# EAGLE schematic Attenuator (EAGLE 9.6.2)
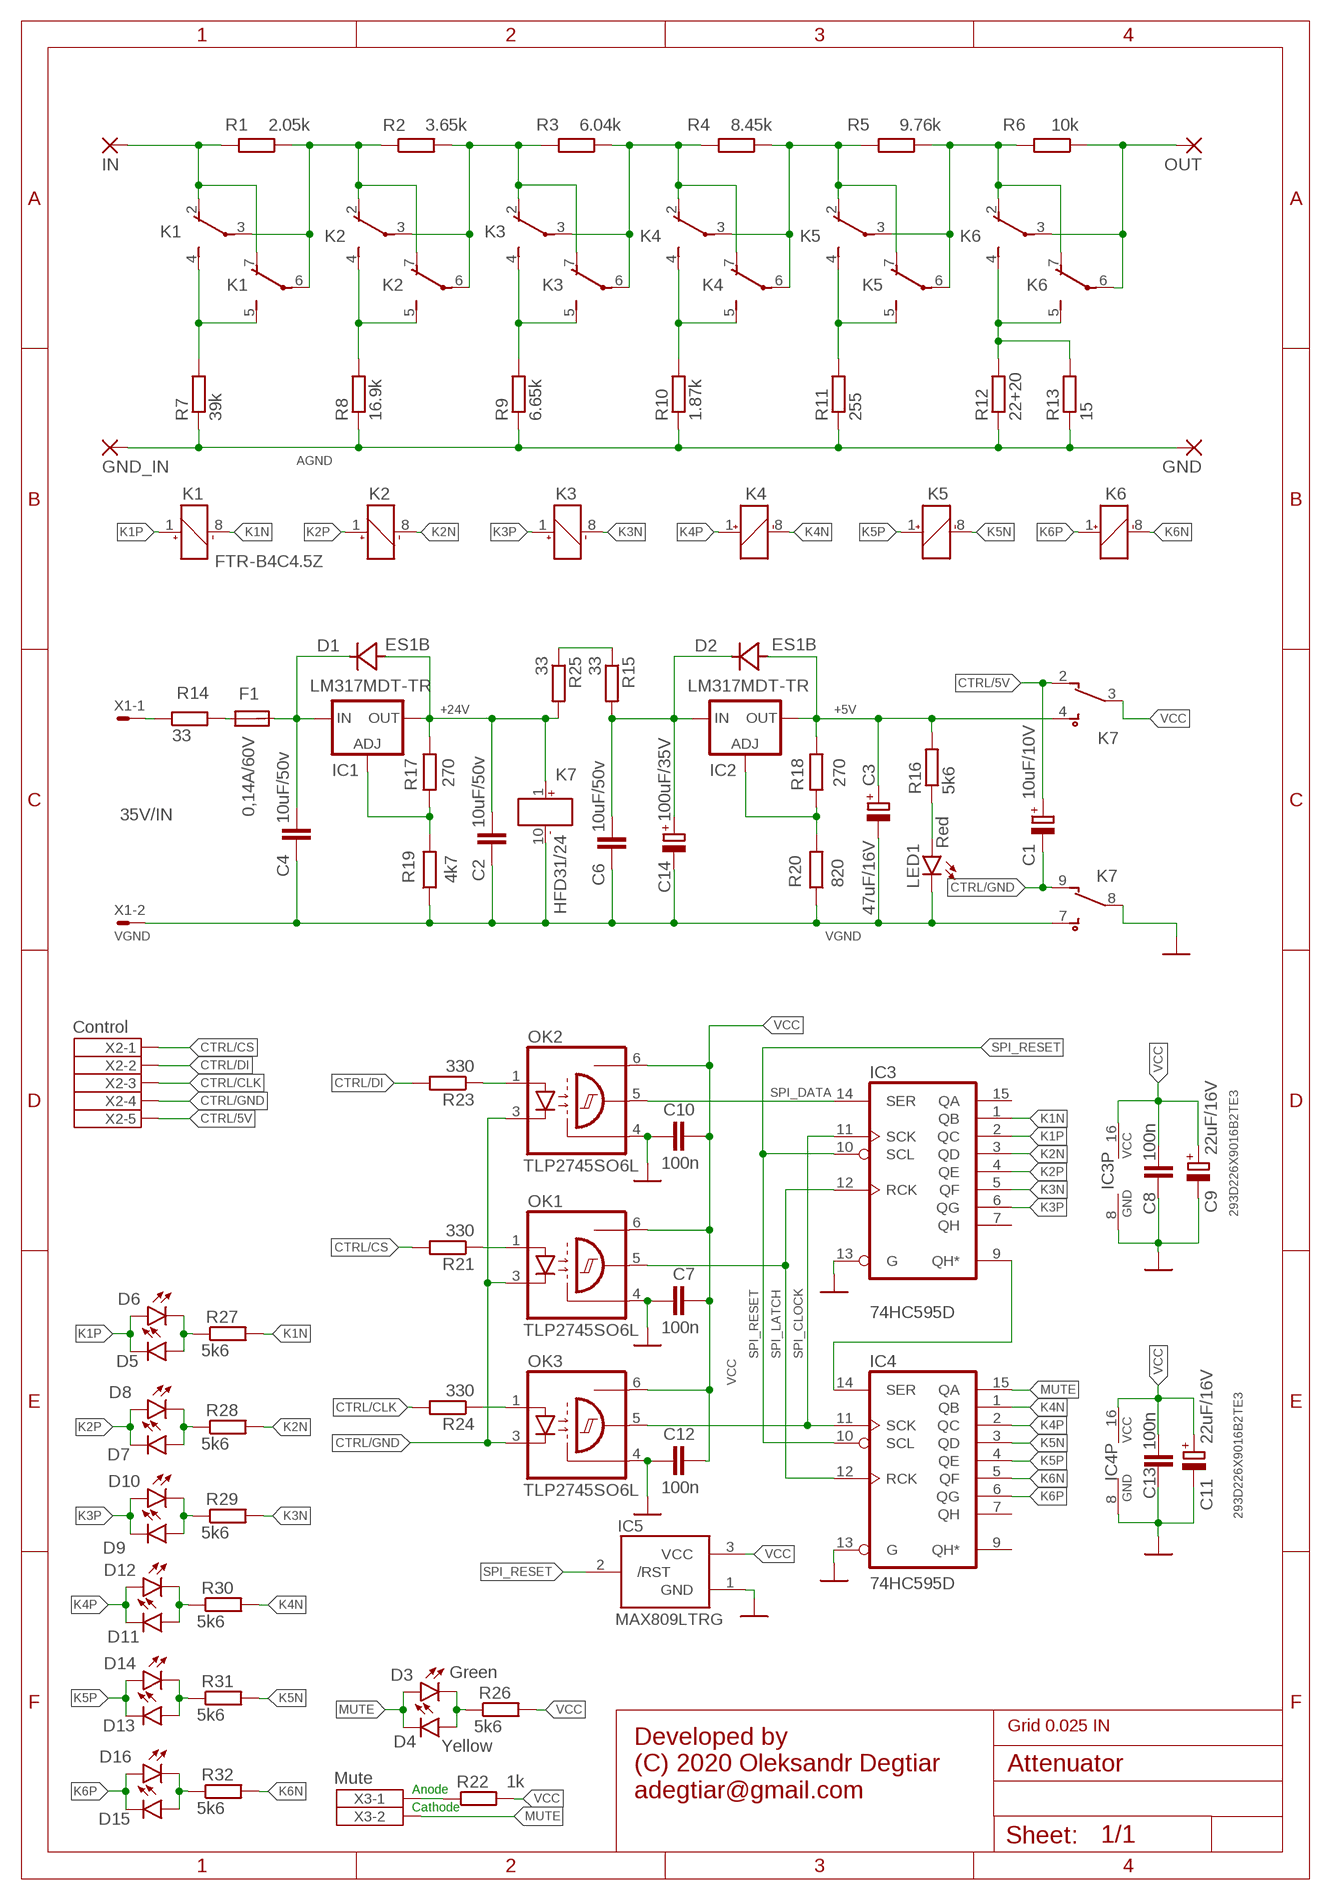
[diagram p0: schematic, sheet 1]

## Parts
C1  10uF/10V  CPOL-EUSMCA  [SMC_A]
C2  10uF/50v  C-EUC1206  [C1206]
C3  47uF/16V  CPOL-EUSMCC  [SMC_C]
C4  10uF/50v  C-EUC1206  [C1206]
C6  10uF/50v  C-EUC1206  [C1206]
C7  100n  C-EUC0603  [C0603]
C8  100n  C-EUC0603  [C0603]
C9  22uF/16V  CPOL-EUSMCB  [SMC_B]
C10  100n  C-EUC0603  [C0603]
C11  22uF/16V  CPOL-EUSMCB  [SMC_B]
C12  100n  C-EUC0603  [C0603]
C13  100n  C-EUC0603  [C0603]
C14  100uF/35V  CPOL-EUUD-6,3X8,8  [UD-6,3X5,8_NICHICON]
D1  ES1B  MBRA340T3  [SMA]
D2  ES1B  MBRA340T3  [SMA]
D3  Green  LEDCHIPLED_0805  [CHIPLED_0805]
D4  Yellow  LEDCHIPLED_0805  [CHIPLED_0805]
D5  LEDCHIPLED_0805  [CHIPLED_0805]
D6  LEDCHIPLED_0805  [CHIPLED_0805]
D7  LEDCHIPLED_0805  [CHIPLED_0805]
D8  LEDCHIPLED_0805  [CHIPLED_0805]
D9  LEDCHIPLED_0805  [CHIPLED_0805]
D10  LEDCHIPLED_0805  [CHIPLED_0805]
D11  LEDCHIPLED_0805  [CHIPLED_0805]
D12  LEDCHIPLED_0805  [CHIPLED_0805]
D13  LEDCHIPLED_0805  [CHIPLED_0805]
D14  LEDCHIPLED_0805  [CHIPLED_0805]
D15  LEDCHIPLED_0805  [CHIPLED_0805]
D16  LEDCHIPLED_0805  [CHIPLED_0805]
F1  0,14A/60V  MF-MSMF010-2  [MF-MSMF010-2]
GND  OUT_GND  2,54/1,1  [2,54/1,1]
GND_IN  IN_GND  2,54/1,1  [2,54/1,1]
IC1  LM317MDT-TR  LM317MBDTRK  [DPACK]
IC2  LM317MDT-TR  LM317MDT  [DPACK]
IC3  74HC595D  [SO16]
IC4  74HC595D  [SO16]
IC5  MAX809LTRG  MAX809JEUR  [SOT23]
IN  IN  2,54/1,1  [2,54/1,1]
K1  FTR-B4C4.5Z  FTR-B4C  [FTR-B4C]
K2  FTR-B4C4.5Z  FTR-B4C  [FTR-B4C]
K3  FTR-B4C4.5Z  FTR-B4C  [FTR-B4C]
K4  FTR-B4C4.5Z  FTR-B4C  [FTR-B4C]
K5  FTR-B4C4.5Z  FTR-B4C  [FTR-B4C]
K6  FTR-B4C4.5Z  FTR-B4C  [FTR-B4C]
K7  HFD31/24  HFD31  [HFD31]
LED1  Red  LEDCHIPLED_0805  [CHIPLED_0805]
OK1  TLP2745SO6L  [SO6L]
OK2  TLP2745SO6L  [SO6L]
OK3  TLP2745SO6L  [SO6L]
OUT  OUT  2,54/1,1  [2,54/1,1]
R1  2.05k  R-EU_R0805  [R0805]
R2  3.65k  R-EU_R0805  [R0805]
R3  6.04k  R-EU_R0805  [R0805]
R4  8.45k  R-EU_R0805  [R0805]
R5  9.76k  R-EU_R0805  [R0805]
R6  10k  R-EU_R0805  [R0805]
R7  39k  R-EU_R0805  [R0805]
R8  16.9k  R-EU_R0805  [R0805]
R9  6.65k  R-EU_R0805  [R0805]
R10  1.87k  R-EU_R0805  [R0805]
R11  255  R-EU_R0805  [R0805]
R12  22+20  R-EU_R0805  [R0805]
R13  15  R-EU_R0805  [R0805]
R14  33  R-EU_R1206  [R1206]
R15  33  R-EU_R1206  [R1206]
R16  5k6  R-EU_R0805  [R0805]
R17  270  R-EU_R0805  [R0805]
R18  270  R-EU_R0805  [R0805]
R19  4k7  R-EU_R0805  [R0805]
R20  820  R-EU_R0805  [R0805]
R21  330  R-EU_R0805  [R0805]
R22  1k  R-EU_R0805  [R0805]
R23  330  R-EU_R0805  [R0805]
R24  330  R-EU_R0805  [R0805]
R25  33  R-EU_R1206  [R1206]
R26  5k6  R-EU_R0805  [R0805]
R27  5k6  R-EU_R0805  [R0805]
R28  5k6  R-EU_R0805  [R0805]
R29  5k6  R-EU_R0805  [R0805]
R30  5k6  R-EU_R0805  [R0805]
R31  5k6  R-EU_R0805  [R0805]
R32  5k6  R-EU_R0805  [R0805]
X1  35V/IN  KK-156-2  [KK-156-2]
X2  Control  JST-XH-05-PIN-ROUND-PAD  [JST-XH-05-PACKAGE-ROUND-PAD]
X3  Mute  JST-XH-02-PIN-ROUND-PAD  [JST-XH-02-PACKAGE-ROUND-PAD]

## Nets
+5V: C3.+ D2.A IC2.4(OUT) K7.4(NO) R16.2 R18.1
+24V: C2.1 D1.A IC1.4(OUT) K7.1(K$1:+) R17.1 R25.2
+24V/IN: C6.1 C14.+ D2.C IC2.3(IN) R15.2
+35V/FUSE: F1.1 R14.2
+35V/IN: R14.1 X1.1
ADJ_VR1: IC1.1(ADJ) R17.2 R19.2
ADJ_VR2: IC2.1(ADJ) R18.2 R20.2
AGND: GND.1(P) GND_IN.1(P) R7.1 R8.1 R9.1 R10.1 R11.1 R12.1 R13.1
CTRL/5V: C1.+ K7.2(NC) X2.5
CTRL/CLK: R24.2 X2.3
CTRL/CS: R21.2 X2.1
CTRL/DI: R23.2 X2.2
CTRL/GND: C1.- K7.9(NC) OK1.3(C) OK2.3(C) OK3.3(C) X2.4
GND: C7.2 C8.2 C9.- C10.2 C11.- C12.2 C13.1 IC3.8(GND) IC3.13(G) IC4.8(GND) IC4.13(G) IC5.1(GND) K7.8(COM) OK1.4(GND) OK2.4(GND) OK3.4(GND)
K1N: IC3.1(QB) K1.8(K:-) R27.2
K1P: D5.C D6.A IC3.2(QC) K1.1(K:+)
K2N: IC3.3(QD) K2.8(K:-) R28.2
K2P: D7.C D8.A IC3.4(QE) K2.1(K:+)
K3N: IC3.5(QF) K3.8(K:-) R29.2
K3P: D9.C D10.A IC3.6(QG) K3.1(K:+)
K4N: IC4.1(QB) K4.8(K:-) R30.2
K4P: D11.C D12.A IC4.2(QC) K4.1(K:+)
K5N: IC4.3(QD) K5.8(K:-) R31.2
K5P: D13.C D14.A IC4.4(QE) K5.1(K:+)
K6N: IC4.5(QF) K6.8(K:-) R32.2
K6P: D15.C D16.A IC4.6(QG) K6.1(K:+)
LED_PWR_ON: LED1.A R16.1
MUTE: D3.A D4.C IC4.15(QA) X3.2
N$1: K5.4(-1:S) K5.5(-2:S) R11.2
N$2: K3.4(-1:S) K3.5(-2:S) R9.2
N$3: K2.4(-1:S) K2.5(-2:S) R8.2
N$4: K1.4(-1:S) K1.5(-2:S) R7.2
N$5: D5.A D6.C R27.1
N$6: K4.4(-1:S) K4.5(-2:S) R10.2
N$7: K4.3(-1:P) K4.6(-2:P) K5.2(-1:O) K5.7(-2:O) R4.1 R5.2
N$8: K1.3(-1:P) K1.6(-2:P) K2.2(-1:O) K2.7(-2:O) R1.1 R2.1
N$9: IN.1(P) K1.2(-1:O) K1.7(-2:O) R1.2
N$10: K2.3(-1:P) K2.6(-2:P) K3.2(-1:O) K3.7(-2:O) R2.2 R3.2
N$11: K3.3(-1:P) K3.6(-2:P) K4.2(-1:O) K4.7(-2:O) R3.1 R4.2
N$12: K6.3(-1:P) K6.6(-2:P) OUT.1(P) R6.1
N$13: R15.1 R25.1
N$14: D3.C D4.A R26.1
N$15: D7.A D8.C R28.1
N$16: R22.1 X3.1
N$17: D9.A D10.C R29.1
N$18: C4.1 D1.C F1.2 IC1.3(IN)
N$19: K5.3(-1:P) K5.6(-2:P) K6.2(-1:O) K6.7(-2:O) R5.1 R6.2
N$20: D11.A D12.C R30.1
N$21: D13.A D14.C R31.1
N$22: D15.A D16.C R32.1
N$28: K6.4(-1:S) K6.5(-2:S) R12.2 R13.2
N$36: OK1.1(A) R21.1
N$37: OK2.1(A) R23.1
N$43: OK3.1(A) R24.1
RG_CHAIN: IC3.9(QH*) IC4.14(SER)
SPI_CLOCK: IC3.11(SCK) IC4.11(SCK) OK3.5(OUT)
SPI_DATA: IC3.14(SER) OK2.5(OUT)
SPI_LATCH: IC3.12(RCK) IC4.12(RCK) OK1.5(OUT)
SPI_RESET: IC3.10(SCL) IC4.10(SCL) IC5.2(/RST)
VCC: C7.1 C8.1 C9.+ C10.1 C11.+ C12.1 C13.2 IC3.16(VCC) IC4.16(VCC) IC5.3(VCC) K7.3(COM) OK1.6(VCC) OK2.6(VCC) OK3.6(VCC) R22.2 R26.2
VGND: C2.2 C3.- C4.2 C6.2 C14.- K7.7(NO) K7.10(K$1:-) LED1.C R19.1 R20.1 X1.2
Unconnected: IC3.7(QH) IC3.15(QA) IC4.7(QH) IC4.9(QH*)

## Notes on the sheet
- Grid 0.025 IN
- Anode
- Developed by
  (C) 2020 Oleksandr Degtiar
  adegtiar@gmail.com
- Cathode

## Library data of the parts
C1 = rcl:CPOL-EU: POLARIZED CAPACITOR, European symbol; PARTNAME: TAJA106K010RNJ; SPICEPREFIX: C
C2 C4 C6 = rcl:C-EU: CAPACITOR, European symbol; BUY_URL: https://imrad.com.ua/ru/cl31b106kbhnnne-product-244463; PARTNAME: CL31B106KBHNNNE; SPICEPREFIX: C
C3 = rcl:CPOL-EU: POLARIZED CAPACITOR, European symbol; PARTNAME: 293D476X9016C2TE3; SPICEPREFIX: C
C7 C8 C10 C12 C13 = rcl:C-EU: CAPACITOR, European symbol; SPICEPREFIX: C
C9 C11 = rcl:CPOL-EU: POLARIZED CAPACITOR, European symbol; PARTNAME: 293D226X9016B2TE3; SPICEPREFIX: C
C14 = rcl:CPOL-EU: POLARIZED CAPACITOR, European symbol; PARTNAME: EEEFK1V101XP; SPICEPREFIX: C
D1 D2 = diode:MBRA340T3: Surface Mount Schottky Power Rectifier Source: http://www.onsemi.com/pub_link/Collateral/MBRA340T3-D.PDF
D3-D16 LED1 = led:LED: LED OSRAM: - CHIPLED LG R971, LG N971, LY N971, LG Q971, LY Q971, LO R971, LY R971 LH N974, LH R974 LS Q976, LO Q976, LY Q976 LO Q996 - Hyper CHIPLED LW Q18S LB Q993, LB Q99A, LB R99A - SideLED LS A670, LO A670, LY A670, LG A670, LP A670 LB A673, LV A673, LT A673, LW A673 LH A674 LY A675 LS A676, LA A676, LO A676, LY A676, LW A676 LS A679, LY A679, LG A679 - Hyper Micro SIDELED® LS Y876, LA Y876, LO Y876, LY Y876 LT Y87S - SmartLED LW L88C, LW L88S LB L89C, LB L89S, LG L890 LS L89K, LO L89K, LY L89K LS L896, LA L896, LO L896, LY L896 - TOPLED LS T670, LO T670, LY T670, LG T670, LP T670 LSG T670, LSP T670, LSY T670, LOP T670, LYG T670 LG T671, LOG T671, LSG T671 LB T673, LV T673, LT T673, LW T673 LH T674 LS T676, LA T676, LO T676, LY T676, LB T676, LH T676, LSB T676, LW T676 LB T67C, LV T67C, LT T67C, LS T67K, LO T67K, LY T67K, LW E67C LS E67B, LA E67B, LO E67B, LY E67B, LB E67C, LV E67C, LT E67C LW T67C LS T679, LY T679, LG T679 LS T770, LO T770, LY T770, LG T770, LP T770 LB T773, LV T773, LT T773, LW T773 LH T774 LS E675, LA E675, LY E675, LS T675 LS T776, LA T776, LO T776, LY T776, LB T776 LHGB T686 LT T68C, LB T68C - Hyper Mini TOPLED® LB M676 - Mini TOPLED Santana® LG M470 LS M47K, LO M47K, LY M47K Source: http://www.osram.convergy.de LUXEON: - LUMILED® LXK2-PW12-R00, LXK2-PW12-S00, LXK2-PW14-U00, LXK2-PW14-V00 LXK2-PM12-R00, LXK2-PM12-S00, LXK2-PM14-U00 LXK2-PE12-Q00, LXK2-PE12-R00, LXK2-PE12-S00, LXK2-PE14-T00, LXK2-PE14-U00 LXK2-PB12-K00, LXK2-PB12-L00, LXK2-PB12-M00, LXK2-PB14-N00, LXK2-PB14-P00, LXK2-PB14-Q00 LXK2-PR12-L00, LXK2-PR12-M00, LXK2-PR14-Q00, LXK2-PR14-R00 LXK2-PD12-Q00, LXK2-PD12-R00, LXK2-PD12-S00 LXK2-PH12-R00, LXK2-PH12-S00 LXK2-PL12-P00, LXK2-PL12-Q00, LXK2-PL12-R00 Source: www.luxeon.com KINGBRIGHT: KA-3528ASYC Source: www.kingbright.com
F1 = Fuse:MF-MSMF010-2; TITLE: MF-MSMF014-2
GND GND_IN IN OUT = wirepad:2,54/1,1: THROUGH-HOLE PAD
IC1 = v-reg:LM317?*: 500 mA Adjustable Output Positive Voltage Regulator Source: http://www.onsemi.co.jp .. LM317M-D.PDF; COST: 6.50 UAH; URL_BUY: http://www.kosmodrom.com.ua/el.php?name=LM317MDT-TR
IC2 = v-reg:LM317?*: 500 mA Adjustable Output Positive Voltage Regulator Source: http://www.onsemi.co.jp .. LM317M-D.PDF; COST: 9.55; PARTNAME: LM317MDTG
IC3 IC4 = 74xx-eu:74*595: 8-bit SHIFT REGISTER, output latch
IC5 = maxim-10:MAX809*: 3-Pin Microprocessor Reset Circuit; BUY_URL: https://imrad.com.ua/ru/max809ltrg; PARTNAME: MAX809LTRG
K1-K6 = relay:FTR-B4: ULTRA MINIATURE RELAY 2 POLES - 2 A (Slim Profile Signal Relay) FUJITSU FTR-B4 SERIES Source: FTR-B4.pdf
K7 = Relays:HFD31: Hongfa HFD31 miniature signal relay
OK1-OK3 = optocoupler2:TLP2745: TOSHIBA TLP2745 OPTO COUPLER
R1-R32 = rcl:R-EU_: RESISTOR, European symbol; SPICEPREFIX: R
X1 = con-molex:KK-156-2: KK 156 HEADER Source: http://www.molex.com/pdm_docs/sd/026604100_sd.pdf; MF: MOLEX; OC_FARNELL: unknown; OC_NEWARK: unknown
X2 = JST XH Connectors v1-0:JST-XH-05-PIN: JST XH Connector 2 Pin Wire to board connector. Pitch: 2,54 mm, (0.100") Number of pins: 5 Created by Rembrandt Electronics www.rembrandtelectronics.com
X3 = JST XH Connectors v1-0:JST-XH-02-PIN: JST XH Connector 2 Pin Wire to board connector. Pitch: 2,54 mm, (0.100") Number of pins: 2 Created by Rembrandt Electronics www.rembrandtelectronics.com